# EAGLE design board (EAGLE 6.4)
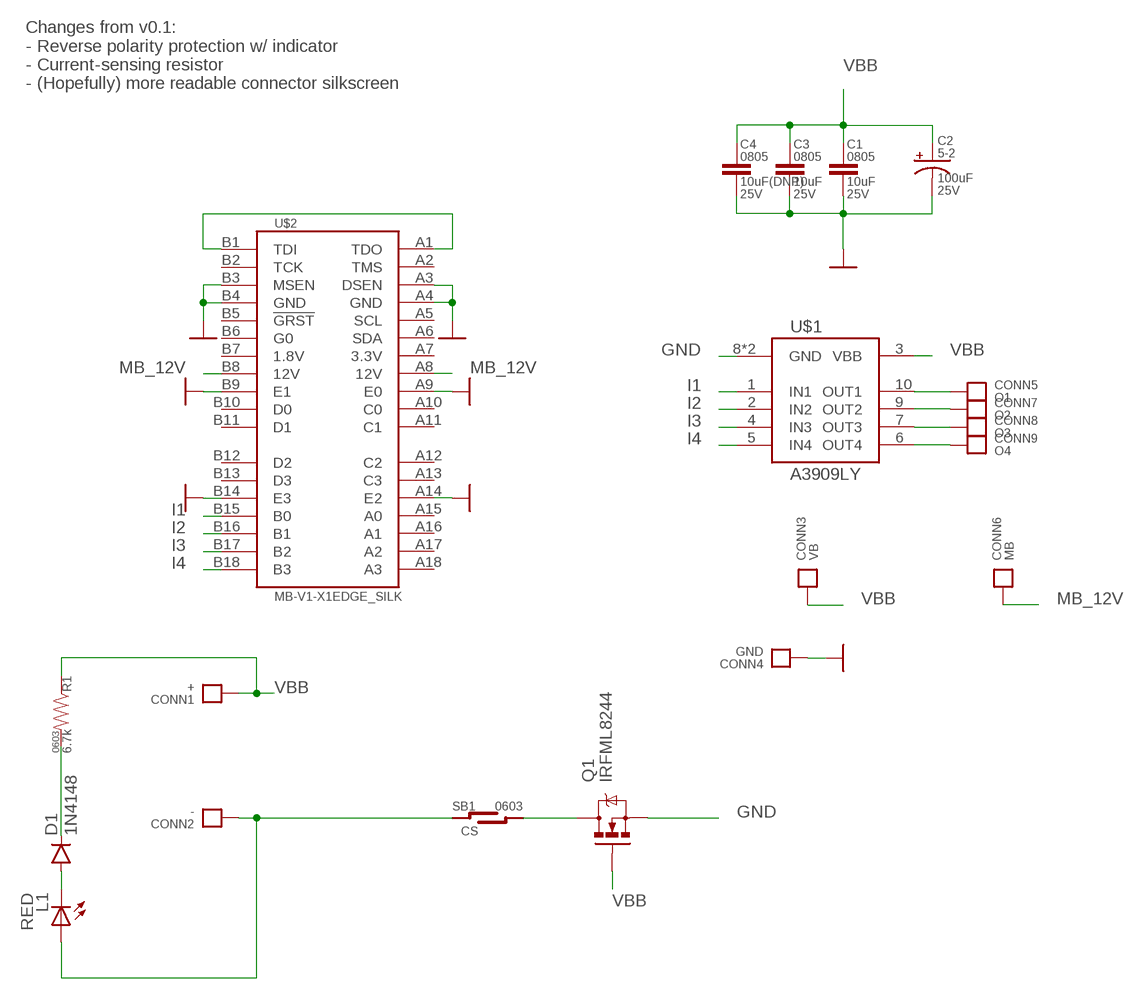
[diagram p0: schematic, sheet 1]

## Parts
C1  10uF  CAP0805  [0805-CAP]
C2  100uF  CAP_POLPTH-5-2  [CAP-5-2]
C3  10uF  CAP0805  [0805-CAP]
C4  10uF(DNP)  CAP0805  [0805-CAP]
CONN1  +  CONNECTORSCREW_5MM  [SCREW_5MM]
CONN2  -  CONNECTORSCREW_5MM  [SCREW_5MM]
CONN3  VB  CONNECTORSCREW_2.5MM  [SCREW_2.5MM]
CONN4  GND  CONNECTORSCREW_2.5MM  [SCREW_2.5MM]
CONN5  O1  CONNECTORSCREW_2.5MM  [SCREW_2.5MM]
CONN6  MB  CONNECTORSCREW_2.5MM  [SCREW_2.5MM]
CONN7  O2  CONNECTORSCREW_2.5MM  [SCREW_2.5MM]
CONN8  O3  CONNECTORSCREW_2.5MM  [SCREW_2.5MM]
CONN9  O4  CONNECTORSCREW_2.5MM  [SCREW_2.5MM]
D1  1N4148  DIODESOD  [SOD-323]
L1  RED  LED0603  [0603_LED]
Q1  IRFML8244  MOSFET-NCHANNELBSS138  [SOT23]
R1  6.7k  RESISTOR0603  [0603-RES]
SB1  CS  SOLDER-BRIDGE0603  [SB-0603]
U$1  A3909LY  [MSOP10]
U$2  MB-V1-X1EDGE_SILK  [MB-V1-X1-EDGE]

## Nets
GND: C1.2 C2.2(-) C3.2 C4.2 CONN4.P Q1.2(S) U$1.8(GND) U$1.PAD(GND) U$2.A3(DSEN) U$2.A4(GND) U$2.A9(E0) U$2.A14(E2) U$2.B3(MSEN) U$2.B4(GND) U$2.B9(E1) U$2.B14(E3)
I1: U$1.1(IN1) U$2.B15(B0)
I2: U$1.2(IN2) U$2.B16(B1)
I3: U$1.4(IN3) U$2.B17(B2)
I4: U$1.5(IN4) U$2.B18(B3)
MB_12V: CONN6.P U$2.A8(12V) U$2.B8(12V)
N$1: U$2.A1(TDO) U$2.B1(TDI)
N$2: D1.A L1.C
N$3: CONN2.P$1(P) L1.A SB1.L1 SB1.L2
N$4: Q1.3(D) SB1.R1 SB1.R2
N$5: D1.C R1.2
O1: CONN5.P U$1.10(OUT1)
O2: CONN7.P U$1.9(OUT2)
O3: CONN8.P U$1.7(OUT3)
O4: CONN9.P U$1.6(OUT4)
VBB: C1.1 C2.1(+) C3.1 C4.1 CONN1.P$1(P) CONN3.P Q1.1(G) R1.1 U$1.3(VBB)
Unconnected: U$2.A2(TMS) U$2.A5(SCL) U$2.A6(SDA) U$2.A7(3.3V) U$2.A10(C0) U$2.A11(C1) U$2.A12(C2) U$2.A13(C3) U$2.A15(A0) U$2.A16(A1) U$2.A17(A2) U$2.A18(A3) U$2.B2(TCK) U$2.B5(!GRST) U$2.B6(G0) U$2.B7(1.8V) U$2.B10(D0) U$2.B11(D1) U$2.B12(D2) U$2.B13(D3)

## Notes on the sheet
- Changes from v0.1:
  - Reverse polarity protection w/ indicator
  - Current-sensing resistor
  - (Hopefully) more readable connector silkscreen

## Library data of the parts
C1 C3 C4 = kmod-passives:CAP: Capacitor Standard 0603 ceramic capacitor, and 0.1" leaded capacitor.; PACKAGE: 0805; VOLTAGE: 25V
C2 = kmod-passives:CAP_POL: Capacitor Polarized These are standard SMD and PTH capacitors. Normally 10uF, 47uF, and 100uF in electrolytic and tantalum varieties. Always verify the external diameter of the through hole cap, it varies with capacity, voltage, and manufacturer. The EIA devices should be standard.; PACKAGE: 5-2; VOLTAGE: 25V
CONN1-CONN9 = kmod-nonparts:CONNECTOR: Collection of holes/pads for testing/connecting
D1 = SparkFun-DiscreteSemi:DIODE: Diode These are standard reverse protection diodes and small signal diodes. SMA package can handle up to about 1A. SOD-323 can handle about 200mA. What the SOD-323 package when ordering, there are some mfgs out there that are 5-pin packages.; PROD_ID: DIO-09646
L1 = kmod-passives:LED
Q1 = SparkFun-DiscreteSemi:MOSFET-NCHANNEL: Common NMOSFET Parts MFG P/N Store ID Prod ID FDD8780 TRANS-09984 SI7820DN TRANS-11055 FDS6630A IC-08089 2N7002PW TRANS-11151 FQP30N06L COM-10213 TRANS-10060 BSS123LT1G TRANS-08345 BSS138 TRANS-00830 BS170 2N7000; PROD_ID: TRANS-00830
R1 = kmod-passives:RESISTOR: Resistor Basic schematic elements and footprints for 0603, 1206, and PTH resistors.; PACKAGE: 0603
SB1 = kmod-nonparts:SOLDER-BRIDGE; PACKAGE: 0603
U$1 = kmod-testing:A3909: A3909 Dual Fuul Bridge Motor Driver http://www.allegromicro.com/~/media/Files/Datasheets/A3909-Datasheet.pdf
U$2 = kmod-connectors:MB-V1-X1

## Board
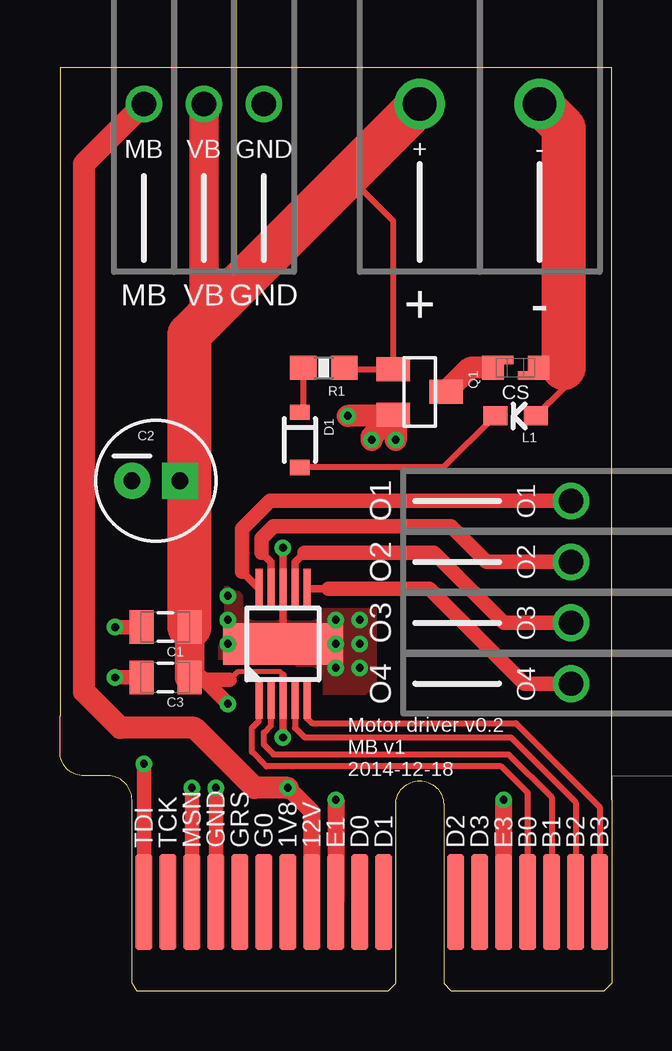
[diagram p1: board, top side]
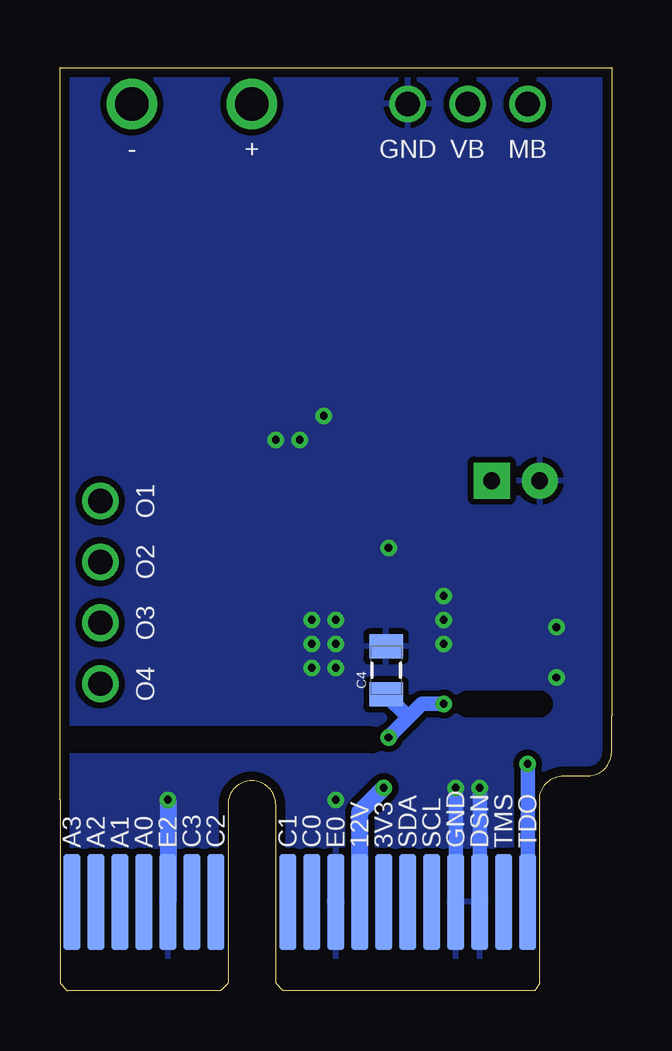
[diagram p2: board, bottom side, seen from below]

Size 23 x 38.45 mm. Coordinates in mm from the lower left corner, seen from the top.
Outline: 23,7.95 23,38.45 0,38.45 0,11.45
Copper layers (1*16): Top 0.0356mm / dielectric 1.5011mm / Bottom 0.0356mm
Design rules "OSHPark_mine": minimum track width 6mil, minimum drill 13mil, track to track 6mil, track to pad 6mil, pad to pad 6mil, via to via 6mil, smd to smd 6mil, copper to edge 15mil, drill to drill 6mil, minimum pad ring 7mil, minimum via ring 7mil, stop-mask expansion 2mil, vias tented up to drill 13mil, thermal gap 10mil
bRestrict: 2 lines

### Footprints (pad centres in the part's own frame; a part is rotated, then mirrored left to right if it is on the bottom)
0805-CAP = smd 1 x 1.4: 1 -1,0; 2 1,0
CAP-5-2 = drill 0.7 pad 1.5 square: 1 1,0 | drill 0.7 pad 1.5: 2 -1,0
SCREW_5MM = drill 1.4: P$1 0,0
SCREW_2.5MM = drill 1.016: P 0,0
SOD-323 = smd 0.63 x 0.83: A 1.15,0; C -1.15,0
0603_LED = smd 0.8 x 1.003: A 0,-0.852; C 0,0.852
SOT23 = smd 1 x 1.4: 1 -0.95,-1.1; 2 0.95,-1.1; 3 0,1.1
0603-RES = smd 1.1 x 1: 1 -0.85,0; 2 0.85,0
SB-0603 = smd 0.9 x 1: L1 -0.95,0; R1 0.95,0 | smd 0.4 x 0.35: L2 -0.3,0.325; R2 0.3,-0.325
MSOP10 = smd 0.3 x 1.65: 1 -1,-2.3; 2 -0.5,-2.3; 3 0,-2.3; 4 0.5,-2.3; 5 1,-2.3; 6 1,2.3; 7 0.5,2.3; 8 0,2.3; 9 -0.5,2.3; 10 -1,2.3 | smd 5 x 1.73: PAD 0,0
MB-V1-X1-EDGE = smd 0.7 x 4 bottom: A1 -11.5,-0.75; A2 -10.5,-0.75; A3 -9.5,-0.75; A4 -8.5,-0.75; A5 -7.5,-0.75; A6 -6.5,-0.75; A7 -5.5,-0.75; A8 -4.5,-0.75; A9 -3.5,-0.75; A10 -2.5,-0.75; A11 -1.5,-0.75; A12 1.5,-0.75; A13 2.5,-0.75; A14 3.5,-0.75; A15 4.5,-0.75; A16 5.5,-0.75; A17 6.5,-0.75; A18 7.5,-0.75 | smd 0.7 x 4: B1 -11.5,-0.75; B2 -10.5,-0.75; B3 -9.5,-0.75; B4 -8.5,-0.75; B5 -7.5,-0.75; B6 -6.5,-0.75; B7 -5.5,-0.75; B8 -4.5,-0.75; B9 -3.5,-0.75; B10 -2.5,-0.75; B11 -1.5,-0.75; B12 1.5,-0.75; B13 2.5,-0.75; B14 3.5,-0.75; B15 4.5,-0.75; B16 5.5,-0.75; B17 6.5,-0.75; B18 7.5,-0.75

### Placement (x,y rotation side)
C1  4.4,15.15 180 top
C2  4,21.25 0 top
C3  4.4,13.05 180 top
C4  9.4,13.35 90 bottom
CONN1  15,36.95 180 top
CONN2  20,36.95 180 top
CONN3  6,36.95 180 top
CONN4  8.5,36.95 180 top
CONN5  21.32,20.41 90 top
CONN6  3.5,36.95 180 top
CONN7  21.32,17.87 90 top
CONN8  21.32,15.33 90 top
CONN9  21.32,12.79 90 top
D1  10,22.95 270 top
L1  19,23.95 90 top
Q1  15,24.95 270 top
R1  11,25.95 180 top
SB1  19,25.95 180 top
U$1  9.3,14.45 0 top
U$2  15,4.45 0 top

### Tracks (layer width: path | path; a pad name or v marks a point on that pad's centre or on a via)
GND  (via drill 0.33)
  Top 0.305: U$1.PAD U$1.8 v9.3,18.45
  Top 0.61: U$2.B3 v5.5,8.45 | v6.5,8.45 U$2.B4 | C3.2 v2.3,13.05 | C1.2 v2.3,15.15
  Top 0.711: v11.5,7.95 U$2.B9 | U$2.B14 v18.5,7.95
  Top 0.914: Q1.2 13.85,23.95 v12,23.95 | Q1.2 13,23.1 v13,22.95 | Q1.2 14,23.9 v14,22.95
  Bottom 0.61: v5.5,8.45 U$2.B3 | U$2.B4 v6.5,8.45
  Bottom 0.711: v18.5,7.95 U$2.B14
  other vias: 12.5,14.45 7,15.45 11.5,13.45 12.5,15.45 7,16.45 11.5,15.45 11.5,14.45 12.5,13.45 7,14.45
  pour Bottom (isolate 0.254): -1,38.95 24,38.95 24,1.45 -1,1.45
  pour Top (isolate 0.508, no thermals): 6.7,16.55 6.7,13.15 7.4,12.45 12.7,12.45 13.1,12.85 13.1,16.35 12.3,17.15 7.3,17.15
I1
  Top 0.254: U$2.B15 19.5,8.25 18.4,9.35 8.6,9.35 8,9.95 8,10.95 8.3,11.25 U$1.1
I2
  Top 0.254: U$2.B16 20.5,8.05 18.7,9.85 8.9,9.85 8.5,10.25 8.5,10.75 8.8,11.05 U$1.2
I3
  Top 0.254: U$1.4 9.8,10.95 10.2,10.55 18.8,10.55 21.5,7.85 U$2.B17
I4
  Top 0.254: U$1.5 10.3,11.35 10.5,11.15 19,11.15 22.5,7.65 U$2.B18
MB_12V  (via drill 0.33)
  Top 0.711: U$2.B8 10.5,7.45 v9.5,8.45
  Top 0.914: v9.5,8.45 8.11,8.45 5.61,10.95 2.5,10.95 1,12.45 1,34.45 CONN6.P
  Bottom 0.711: U$2.B8 10.5,7.45 v9.5,8.45
N$1  (via drill 0.33)
  Top 0.61: v3.5,9.45 U$2.A1
  Bottom 0.61: U$2.A1 v3.5,9.45
N$2
  Top 0.254: L1.C 16,21.8 D1.A
N$3
  Top 0.254: SB1.L2 19.62,25.62 SB1.L1 | 20.85,25.8 21,25.95 21,25.1 L1.A
  Top 0.914: 21,25.95 SB1.L1
  Top 1.829: CONN2.P$1 21,35.95 21,25.95
N$4
  Top 0.254: SB1.R2 18.38,26.27 SB1.R1
  Top 0.914: SB1.R1 17.1,25.95 Q1.3
N$5
  Top 0.254: D1.C 10.15,24.25 R1.2
O1
  Top 0.305: U$1.10 7.6,17.45
  Top 0.61: 7.6,17.45 7.6,19.25 8.76,20.41 CONN5.P
O2
  Top 0.305: U$1.9 8.8,17.85 8.4,18.25
  Top 0.61: 8.4,18.25 8.4,18.85 8.9,19.35 16.3,19.35 17.78,17.87 CONN7.P
O3
  Top 0.305: U$1.7 9.8,17.85 10.2,18.25
  Top 0.61: 10.2,18.25 15.6,18.25 18.52,15.33 CONN8.P
O4
  Top 0.305: U$1.6 11.2,16.75
  Top 0.61: CONN9.P 19.36,12.79 15.4,16.75 11.2,16.75
VBB  (via drill 0.33)
  Top 0.203: 9.3,13.15 9.2,13.28 7.4,13.28 7.07,12.95
  Top 0.254: R1.1 11.9,25.9 Q1.1 13.9,32.05 12,33.95
  Top 0.305: v9.3,10.55 U$1.3 9.3,13.15
  Top 0.61: C2.1 5.2,21.25 5.4,21.45 | v7,11.95 5.9,13.05 C3.1 | 7.07,12.95 5.5,12.95
  Top 1.219: C3.1 C1.1 | CONN3.P 6,27.95
  Top 1.829: C1.1 5.4,21.45 5.4,27.35 6,27.95 12,33.95 CONN1.P$1
  Bottom 0.61: v9.3,10.55 8.46,11.39 | 8.46,11.39 7.9,11.95 v7,11.95 | 8.46,11.39 9.4,12.32 C4.1

### Text on the board
tPlace: Motor driver v0.2 / MB v1 / 2014-12-18